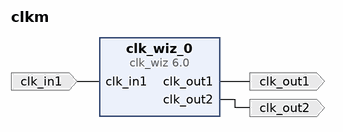
[diagram p0: block diagram of the top level]
# Vivado block design clkm, xcku15p-ffve1517-3-e, Vivado 2022.2
create_bd_design clkm

create_bd_port -dir I -type clk clk_in1
set_property -dict {CONFIG.FREQ_HZ 220000000} [get_bd_ports clk_in1]
create_bd_port -dir O -type clk clk_out1
create_bd_port -dir O -type clk clk_out2

create_bd_cell -type ip -vlnv xilinx.com:ip:clk_wiz:6.0 clk_wiz_0
set_property -dict [list \
  CONFIG.CLKIN1_JITTER_PS 45.449999999999996 \
  CONFIG.CLKOUT1_JITTER 106.000 \
  CONFIG.CLKOUT1_PHASE_ERROR 85.008 \
  CONFIG.CLKOUT1_REQUESTED_OUT_FREQ 110 \
  CONFIG.CLKOUT2_JITTER 92.635 \
  CONFIG.CLKOUT2_PHASE_ERROR 85.008 \
  CONFIG.CLKOUT2_REQUESTED_OUT_FREQ 220 \
  CONFIG.CLKOUT2_USED true \
  CONFIG.MMCM_CLKFBOUT_MULT_F 5.000 \
  CONFIG.MMCM_CLKIN1_PERIOD 4.545 \
  CONFIG.MMCM_CLKIN2_PERIOD 10.0 \
  CONFIG.MMCM_CLKOUT0_DIVIDE_F 10.000 \
  CONFIG.MMCM_CLKOUT1_DIVIDE 5 \
  CONFIG.MMCM_DIVCLK_DIVIDE 1 \
  CONFIG.NUM_OUT_CLKS 2 \
  CONFIG.OPTIMIZE_CLOCKING_STRUCTURE_EN true \
  CONFIG.PRIM_IN_FREQ 220 \
  CONFIG.PRIM_SOURCE No_buffer \
  CONFIG.USE_LOCKED false \
  CONFIG.USE_RESET false \
] [get_bd_cells clk_wiz_0]

# ---- connections ----

connect_bd_net -net clk_in1_1 [get_bd_ports clk_in1] [get_bd_pins clk_wiz_0/clk_in1]
connect_bd_net [get_bd_pins clk_wiz_0/clk_out1] [get_bd_ports clk_out1]
connect_bd_net [get_bd_pins clk_wiz_0/clk_out2] [get_bd_ports clk_out2]

validate_bd_design
save_bd_design
